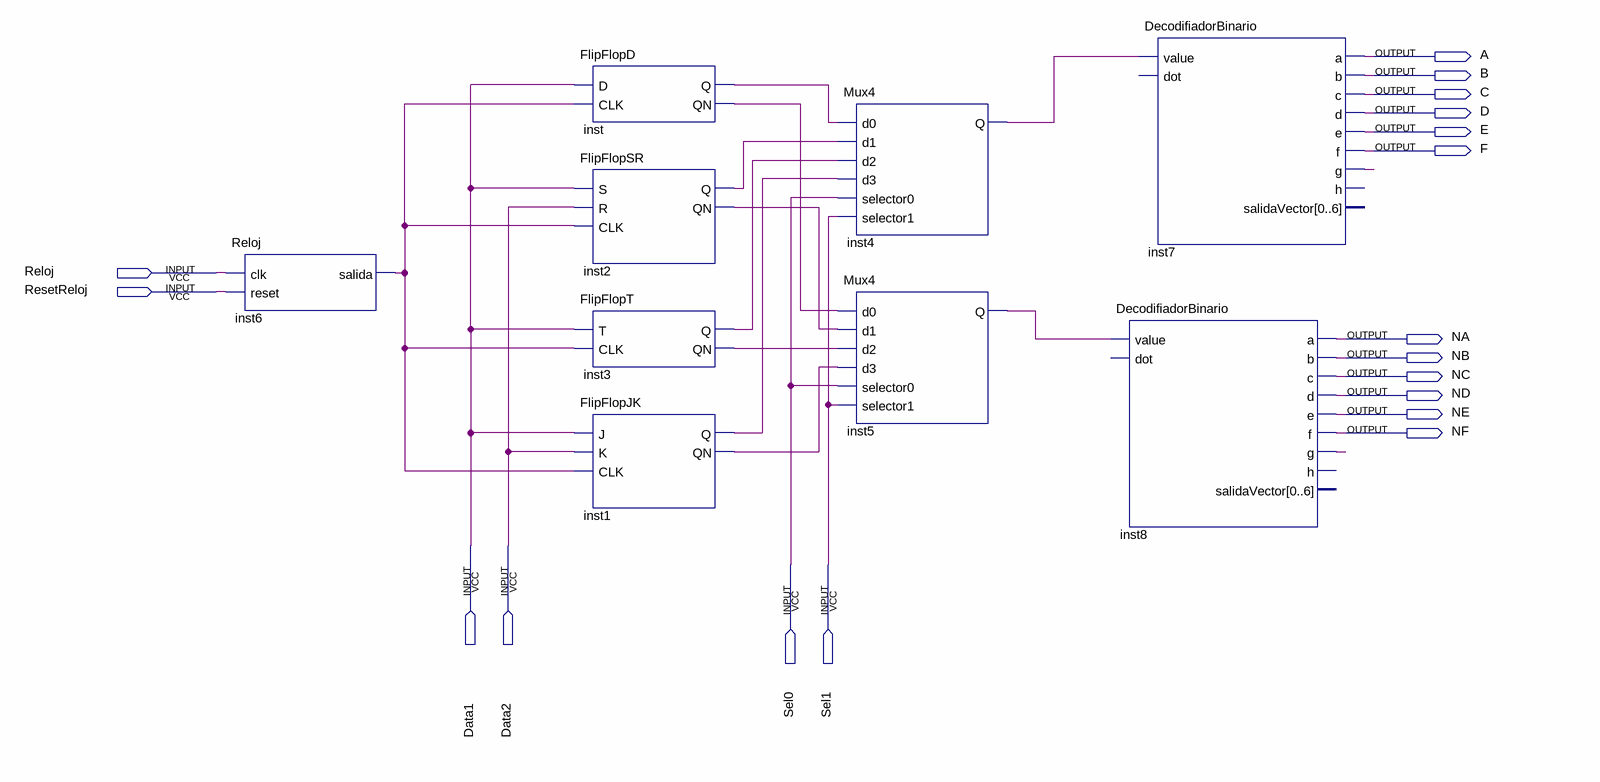
[diagram p0: schematic sheet]
// Quartus schematic Practica1.bdf as structural Verilog: 9 symbols, 18 pins
module Practica1 (
  input  Reloj,
  input  ResetReloj,
  input  Data1,
  input  Data2,
  input  Sel0,
  input  Sel1,
  output A,
  output B,
  output C,
  output D,
  output E,
  output F,
  output NA,
  output NB,
  output NC,
  output ND,
  output NE,
  output NF
);

  wire inst1_q, inst1_qn, inst2_q, inst2_qn, inst3_q, inst3_qn, inst4_q, inst5_q, inst6_salida, inst7_g,
       inst8_g, inst_q, inst_qn;

  Reloj inst6 (.clk(Reloj), .reset(ResetReloj), .salida(inst6_salida));
  FlipFlopD inst (.D(Data1), .CLK(inst6_salida), .Q(inst_q), .QN(inst_qn));
  FlipFlopSR inst2 (.S(Data1), .R(Data2), .CLK(inst6_salida), .Q(inst2_q), .QN(inst2_qn));
  FlipFlopT inst3 (.T(Data1), .CLK(inst6_salida), .Q(inst3_q), .QN(inst3_qn));
  FlipFlopJK inst1 (.J(Data1), .K(Data2), .CLK(inst6_salida), .Q(inst1_q), .QN(inst1_qn));
  Mux4 inst4 (.d0(inst_q), .d1(inst2_q), .d2(inst3_q), .d3(inst1_q), .selector0(Sel0), .selector1(Sel1), .Q(inst4_q));
  Mux4 inst5 (
    .d0(inst_qn), .d1(inst2_qn), .d2(inst3_qn), .d3(inst1_qn), .selector0(Sel0), .selector1(Sel1), .Q(inst5_q));
  DecodifiadorBinario inst7 (
    .value(inst4_q), .a(A), .b(B), .c(C), .d(D), .e(E), .f(F), .g(inst7_g));  // open: dot, h, salidaVector
  DecodifiadorBinario inst8 (
    .value(inst5_q), .a(NA), .b(NB), .c(NC), .d(ND), .e(NE), .f(NF), .g(inst8_g));  // open: dot, h, salidaVector
endmodule
